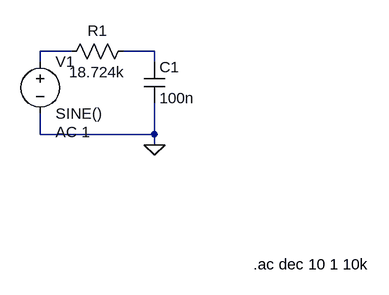
[diagram p0: schematic LPF_HPF.asc]
LPF_HPF.asc, the LTspice schematic file:
Version 4
SHEET 1 880 680
WIRE 112 96 64 96
WIRE 240 96 192 96
WIRE 64 112 64 96
WIRE 240 112 240 96
WIRE 64 224 64 192
WIRE 240 224 240 176
WIRE 240 224 64 224
WIRE 240 240 240 224
FLAG 240 240 0
SYMBOL res 208 80 R90
WINDOW 0 0 56 VBottom 2
WINDOW 3 32 56 VTop 2
SYMATTR InstName R1
SYMATTR Value 18.724k
SYMBOL cap 224 112 R0
SYMATTR InstName C1
SYMATTR Value 100n
SYMBOL voltage 64 96 R0
WINDOW 123 24 124 Left 2
WINDOW 39 0 0 Left 0
SYMATTR Value2 AC 1
SYMATTR InstName V1
SYMATTR Value SINE()
TEXT 392 424 Left 2 !.ac dec 10 1 10k

The netlist it stands for:
* LPF_HPF.asc
R1 N002 N001 18.724k
C1 N002 0 100n
V1 N001 0 SINE() AC 1
.ac dec 10 1 10k
.backanno
.end